# EAGLE design tomada esp-tom (EAGLE 7.3.0)
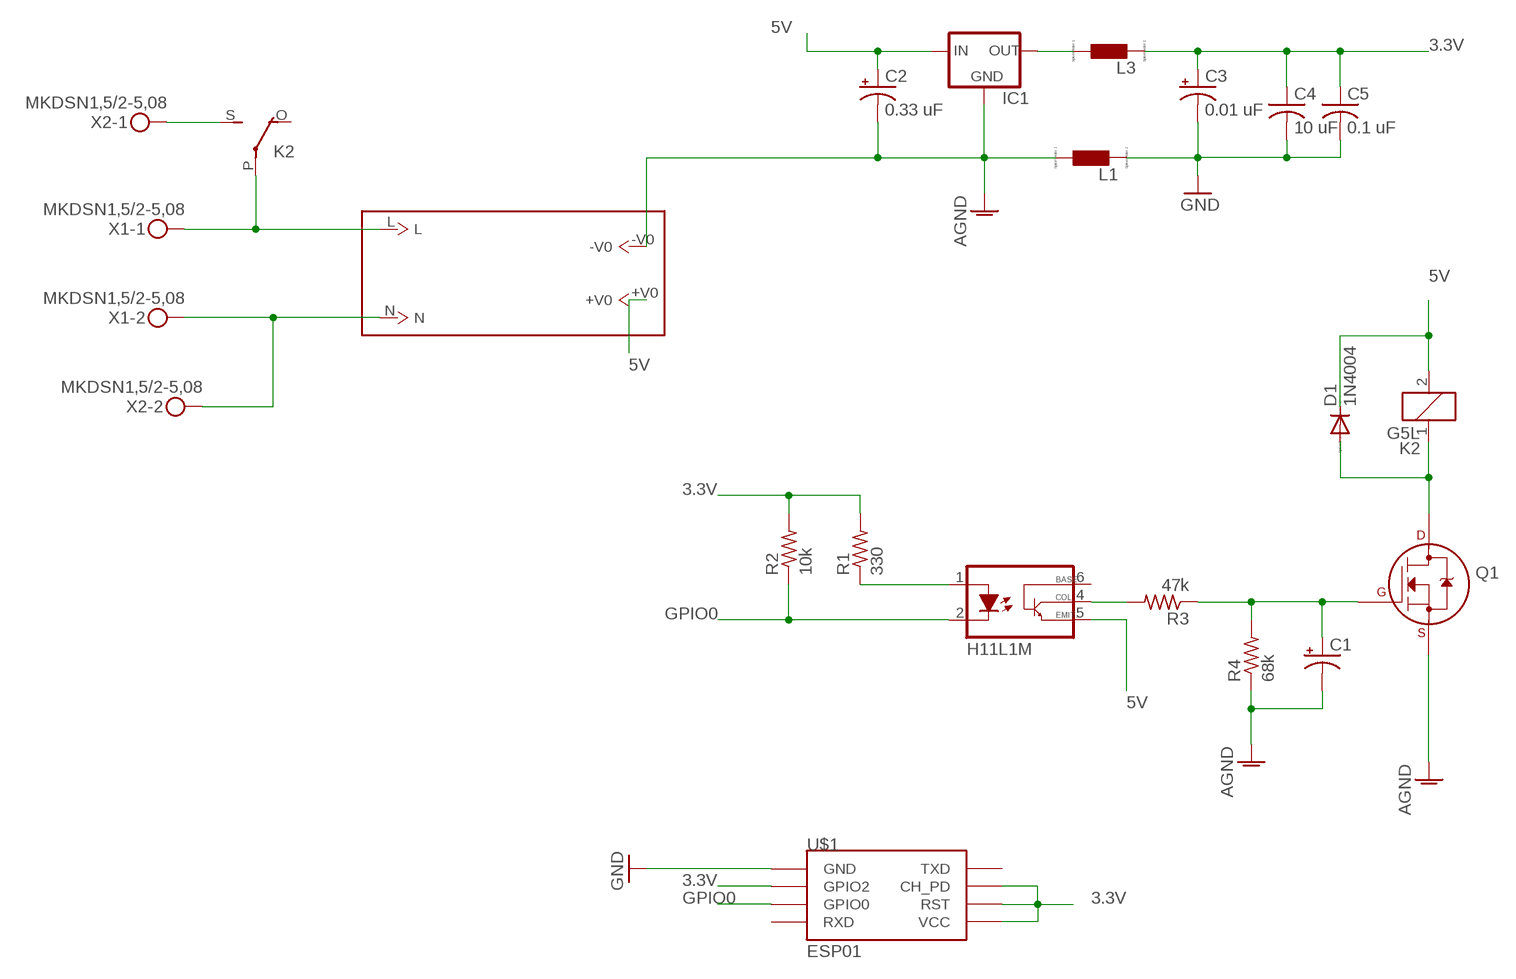
[diagram p0: schematic, sheet 1]

## Parts
C1  CPOL-USE2-5  [E2-5]
C2  0.33 uF  CPOL-USE2-5  [E2-5]
C3  0.01 uF  CPOL-USE2-5  [E2-5]
C4  10 uF  C-US025-024X044  [C025-024X044]
C5  0.1 uF  C-US025-024X044  [C025-024X044]
D1  1N4004  [DO41-10]
IC1  78LXX  [78LXX]
K2  G5L  [G5LE]
L1  L0207/10  [0207/10]
L3  L0207/10  [0207/10]
OK1  H11L1M  [DIL06]
Q1  2N7000_TO92  [TO-92]
R1  330  R-US_0204/7  [0204/7]
R2  10k  R-US_0204/7  [0204/7]
R3  47k  R-US_0204/7  [0204/7]
R4  68k  R-US_0204/7  [0204/7]
U$1  ESP01  [ESP01]
U$2  NA03-T2S05  [NA03-T2S05]
X1  MKDSN1,5/2-5,08  [MKDSN1,5/2-5,08]
X2  MKDSN1,5/2-5,08  [MKDSN1,5/2-5,08]

## Nets
3.3V: C3.+ C4.1 C5.1 L3.2 R1.2 R2.2 U$1.CH_PD U$1.GPIO2 U$1.RST U$1.VCC
5V: C2.+ D1.C IC1.IN K2.2 OK1.5(GND) U$2.+V0
AGND: C1.- C2.- IC1.GND L1.1 Q1.1(S) R4.1 U$2.-V0
GND: C3.- C4.2 C5.2 L1.2 U$1.GND
GPIO0: OK1.2(C) R2.1 U$1.GPIO0
N$1: OK1.1(A) R1.1
N$2: C1.+ Q1.2(G) R3.1 R4.2
N$3: OK1.4(OUT) R3.2
N$4: D1.A K2.1 Q1.3(D)
N$5: K2.S(2:S) X2.1
N$8: K2.P(2:P) U$2.L X1.1
N$9: U$2.N X1.2 X2.2
N$11: IC1.OUT L3.1
Unconnected: K2.O(2:O) U$1.RX(RXD) U$1.TX(TXD)

## Power pins joined to a net without a drawn wire
VCC: OK1.6(VCC)

## Library data of the parts
C1-C3 = rcl:CPOL-US: POLARIZED CAPACITOR, American symbol
C4 C5 = rcl:C-US: CAPACITOR, American symbol
D1 = diode:1N4004: DIODE general purpose rectifier, 1 A
IC1 = v-reg:78LXX: VOLTAGE REGULATOR
K2 = relay:G5L: RELAY 1 x switch, 10 A/120 V AC, 8 A/30 V ADC, Omron; OC_FARNELL: unknown; OC_NEWARK: unknown
L1 L3 = eagle-ltspice:L: INDUCTOR, European symbol; SPICEMODEL: NONE; SPICEPREFIX: L
OK1 = optocoupler2:H11L*M: 6-Pin DIP Optocoupler Source: http://www.fairchildsemi.com/ds/H1/H11L2-M.pdf; MF: FAIRCHILD SEMICONDUCTOR; MPN: H11L1-M; OC_FARNELL: 1021127; OC_NEWARK: 72K8643
Q1 = transistors:2N700*: 2N7000, 2N7002, NDS7002A N-channel enhancement mode MOSFET
R1-R4 = resistor:R-US_: RESISTOR, American symbol
U$1 = esp8266modules:ESP01: ESP8266 Wifi module 01
U$2 = mylibrary:NA03-T2S05
X1 X2 = con-phoenix-508:MKDSN1,5/2-5,08: MKDSN 1,5/ 2-5,08 Printklemme Nennstrom: 13,5 A Nennspannung: 250 V Rastermaß: 5,08 mm Polzahl: 2 Anschlussart: Schraubanschluss Montage: Löten Anschlussrichtung Leiter/Platine: 0 ° Artikelnummer: 1729128 Source: http://eshop.phoenixcontact.com .. 1729128.pdf

## Board
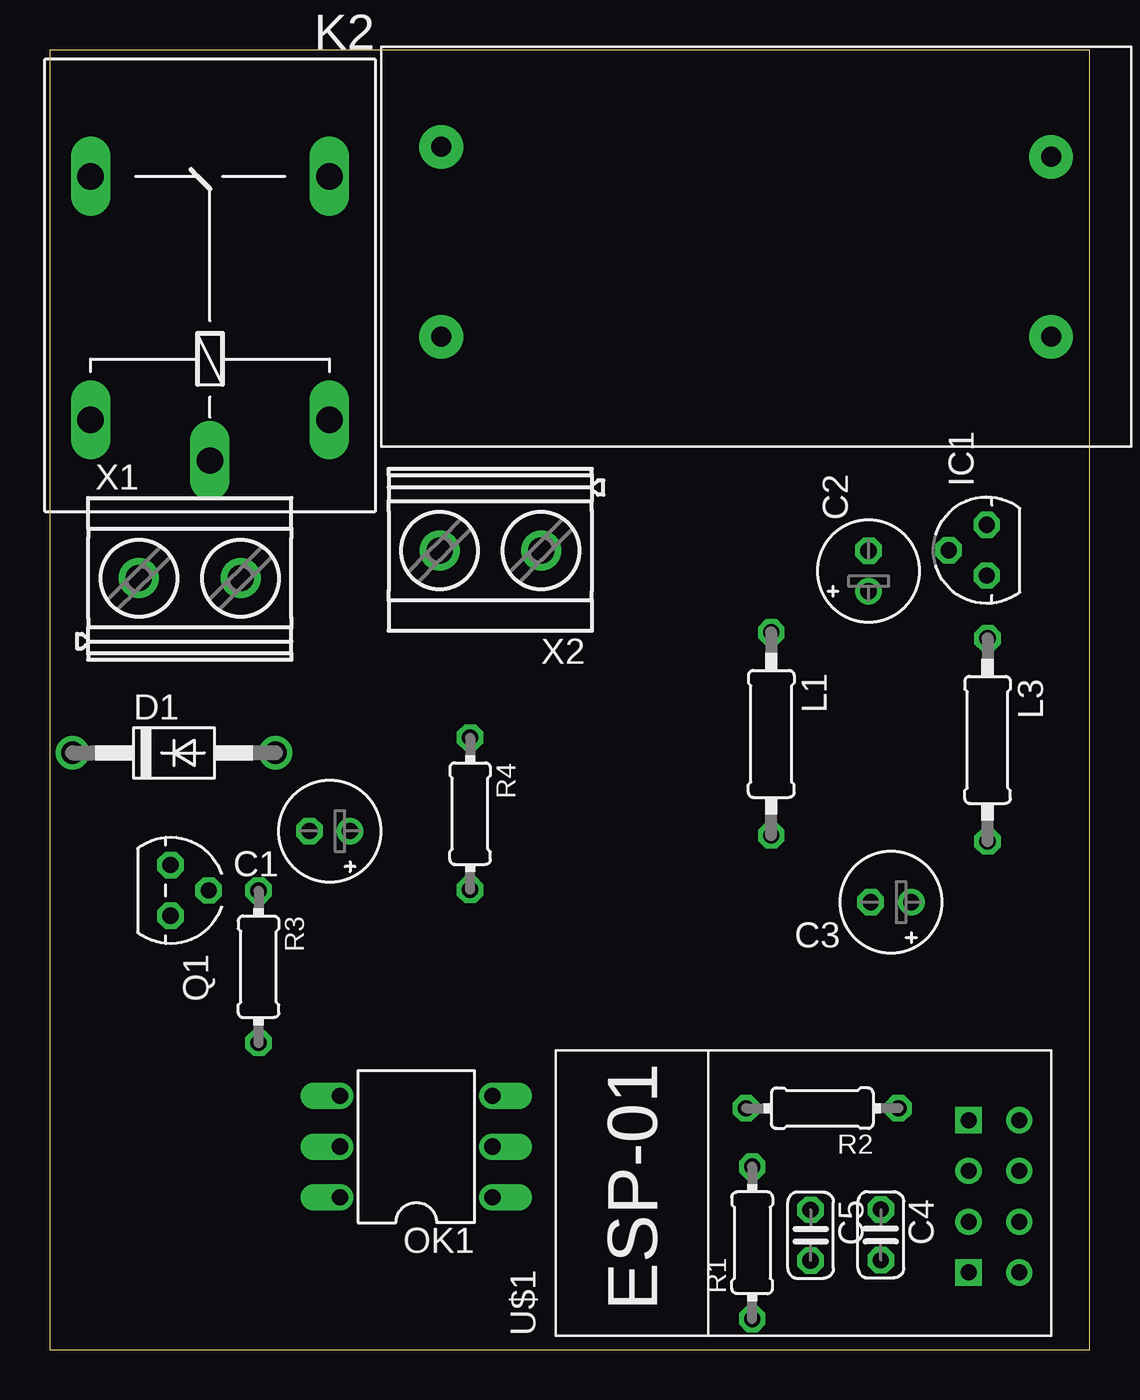
[diagram p1: board, top side]
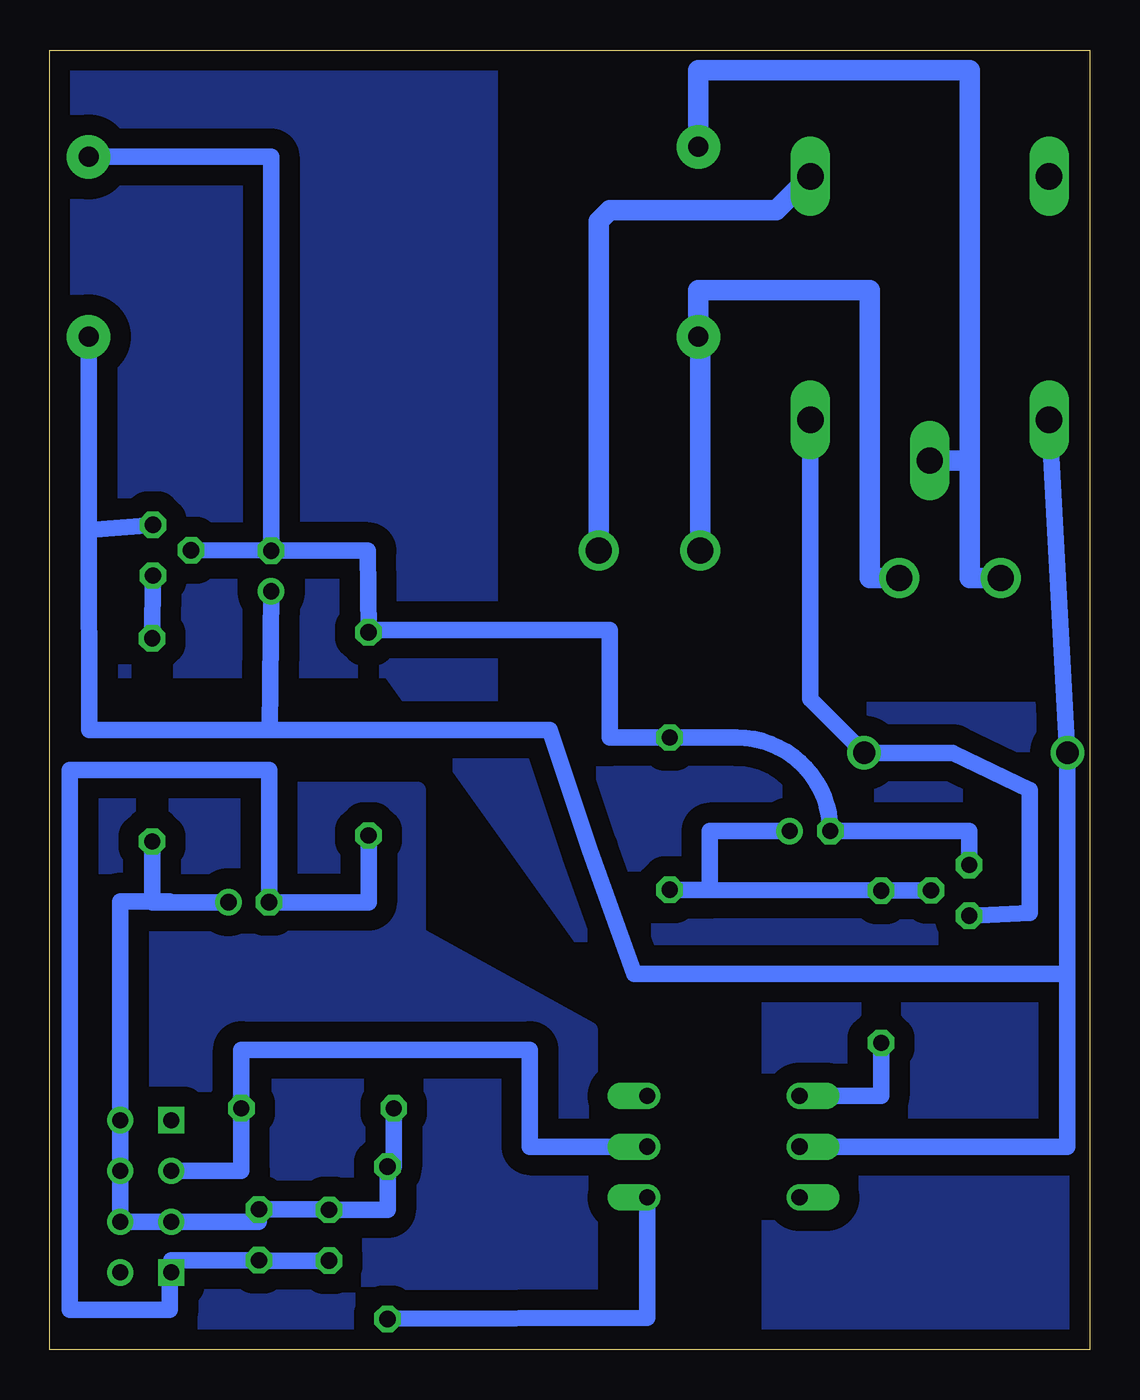
[diagram p2: board, bottom side, seen from below]

Size 52 x 65 mm. Coordinates in mm from the lower left corner, seen from the top.
Outline: 0,0 52,0 52,65 0,65 0,0
Copper layers (1*16): Top 0.035mm / dielectric 1.5mm / Bottom 0.035mm
Design rules "default": minimum track width 10mil, minimum drill 24mil, track to track 8mil, track to pad 8mil, pad to pad 8mil, via to via 8mil, smd to smd 8mil, copper to edge 40mil, drill to drill 8mil, minimum pad ring 10mil, minimum via ring 8mil, stop-mask expansion 4mil, vias tented up to drill 0mil, thermal gap 10mil

### Footprints (pad centres in the part's own frame; a part is rotated, then mirrored left to right if it is on the bottom)
E2-5 = drill 0.813 pad 1.27: + -1.016,0 | drill 0.813 pad 1.27 octagon: - 1.016,0
C025-024X044 = drill 0.813 octagon: 1 -1.27,0; 2 1.27,0
DO41-10 = drill 1.118: A 5.08,0; C -5.08,0
78LXX = drill 0.813 octagon: GND 0,1.905; IN 1.27,0; OUT -1.27,0
G5LE = drill 1.321 long: 1 -7.493,-5.969; 2 -7.493,5.969; O 4.699,5.969; P -9.525,0; S 4.699,-5.969
0207/10 = drill 0.813 octagon: 1 -5.08,0; 2 5.08,0
DIL06 = drill 0.813 offset: 1 -2.54,-3.81; 2 0,-3.81; 3 2.54,-3.81; 4 2.54,3.81; 5 0,3.81; 6 -2.54,3.81
TO-92 = drill 0.813 octagon: 1 -1.27,0; 2 0,1.905; 3 1.27,0
0204/7 = drill 0.813 octagon: 1 -3.81,0; 2 3.81,0
ESP01 = drill 0.8: CH_PD -1.285,-8.178; GPIO0 1.255,-5.638; GPIO2 -1.285,-5.638; RST 1.255,-8.178; TX -3.825,-8.178; VCC 3.795,-8.178 | drill 0.8 square: GND -3.825,-5.638; RX 3.795,-5.638
NA03-T2S05 = drill 1 pad 2.184: +V0 33.5,5.5; -V0 33.5,14.5; L 3,15; N 3,5.5
MKDSN1,5/2-5,08 = drill 1.3 pad 2: 1 -2.561,0.025; 2 2.519,0.025

### Placement (x,y rotation side)
C1  13.99,25.94 180 top
C2  40.94,38.95 90 top
C3  42.06,22.38 180 top
C4  41.55,5.74 270 top
C5  38.04,5.72 270 top
D1  6.2,29.85 0 top
IC1  46.85,39.99 90 top
K2  8,54 90 top
L1  36.07,30.8 270 top
L3  46.89,30.5 270 top
OK1  18.32,10.15 90 top
Q1  6.03,22.97 270 top
R1  35.12,5.34 90 top
R2  38.62,12.07 180 top
R3  10.43,19.15 270 top
R4  21.01,26.81 270 top
U$1  40.3,7.68 90 top
U$2  16.57,45.17 0 top
X1  7.01,38.56 0 top
X2  22,40 180 top

### Tracks (layer width: path | path; a pad name or v marks a point on that pad's centre or on a via)
3.3V
  Bottom 0.813: L3.2 46.89,22.38 46,22.38 | 46,22.38 C3.+ | 46,22.38 46,22.43 48.48,22.43 U$1.VCC U$1.RST U$1.CH_PD U$1.GPIO2 41.55,6.39 C4.1 38.04,7.01 C5.1 35.12,6.99 R1.2 34.81,9.15 R2.2
5V
  Bottom 0.813: 41,31 27,31 25,25 22.79,18.79 1.12,18.79 | 41,31 50.04,31 50.05,41 | C2.+ 41,31 | K2.2 D1.C 1.12,18.79 | U$2.+V0 50.05,41 | IC1.IN 50.05,41 | OK1.5 1.12,10.15 1.12,18.79
AGND
  Bottom 0.813: U$2.-V0 40.94,59.67 C2.- | IC1.GND C2.- | C2.- 36.1,39.97 L1.1 36.07,36 24,36 24,30.62 R4.1 17.65,30.62 arc90 C1.- 6.03,25.94 Q1.1
GND
  Bottom 0.813: L1.2 36.07,22.38 C3.- 41.04,29 51,29 51,2 46,2 46,3.85 U$1.GND 45.94,4.47 C4.2 41.55,4.45 C5.2
GPIO0
  Bottom 0.813: U$1.GPIO0 42.43,8.94 R2.1 42.43,15 28,15 28,10.15 OK1.2
N$1
  Bottom 0.813: OK1.1 22.13,1.59 R1.1
N$2
  Bottom 0.813: Q1.2 R3.1 19,22.99 | 19,22.99 19.99,22.99 R4.2 | C1.+ 19,25.94 19,22.99
N$3
  Bottom 0.813: R3.2 10.43,12.69 OK1.4
N$4
  Bottom 0.813: Q1.3 3,21.85 3,28 6.85,29.85 D1.A 13.97,32.54 K2.1
N$5
  Bottom 1.016: K2.S 15.67,57 24,57 24.56,56.44 X2.1
N$6
  pour Bottom (isolate 1.016): 52,28 33.61,28 33.61,20.75 25,16 25,0 52,0
N$7
  pour Bottom (isolate 1.016): 30,65 30,32 0,32 0,0 16,0 16,20 25,20 35,34 52,34 52,65
N$8
  Bottom 1.016: X1.1 6,38.59 6,44.48 | U$2.L 19.57,64 6,64 6,45 6,44.48 | K2.P 6,44.48
N$9
  Bottom 0.813: U$2.N 19.48,50.67
  Bottom 1.016: X1.2 11,38.59 11,53 19.57,53 U$2.N | 19.48,50.67 X2.2
N$11
  Bottom 0.813: IC1.OUT L3.1